# Altium schematic sheet POWER SUPPLY.SchDoc: POWER SUPPLY
size A3; CheckedBy: HungDV; DrawnBy: HungDV; SheetNumber: 3; SheetTotal: 5
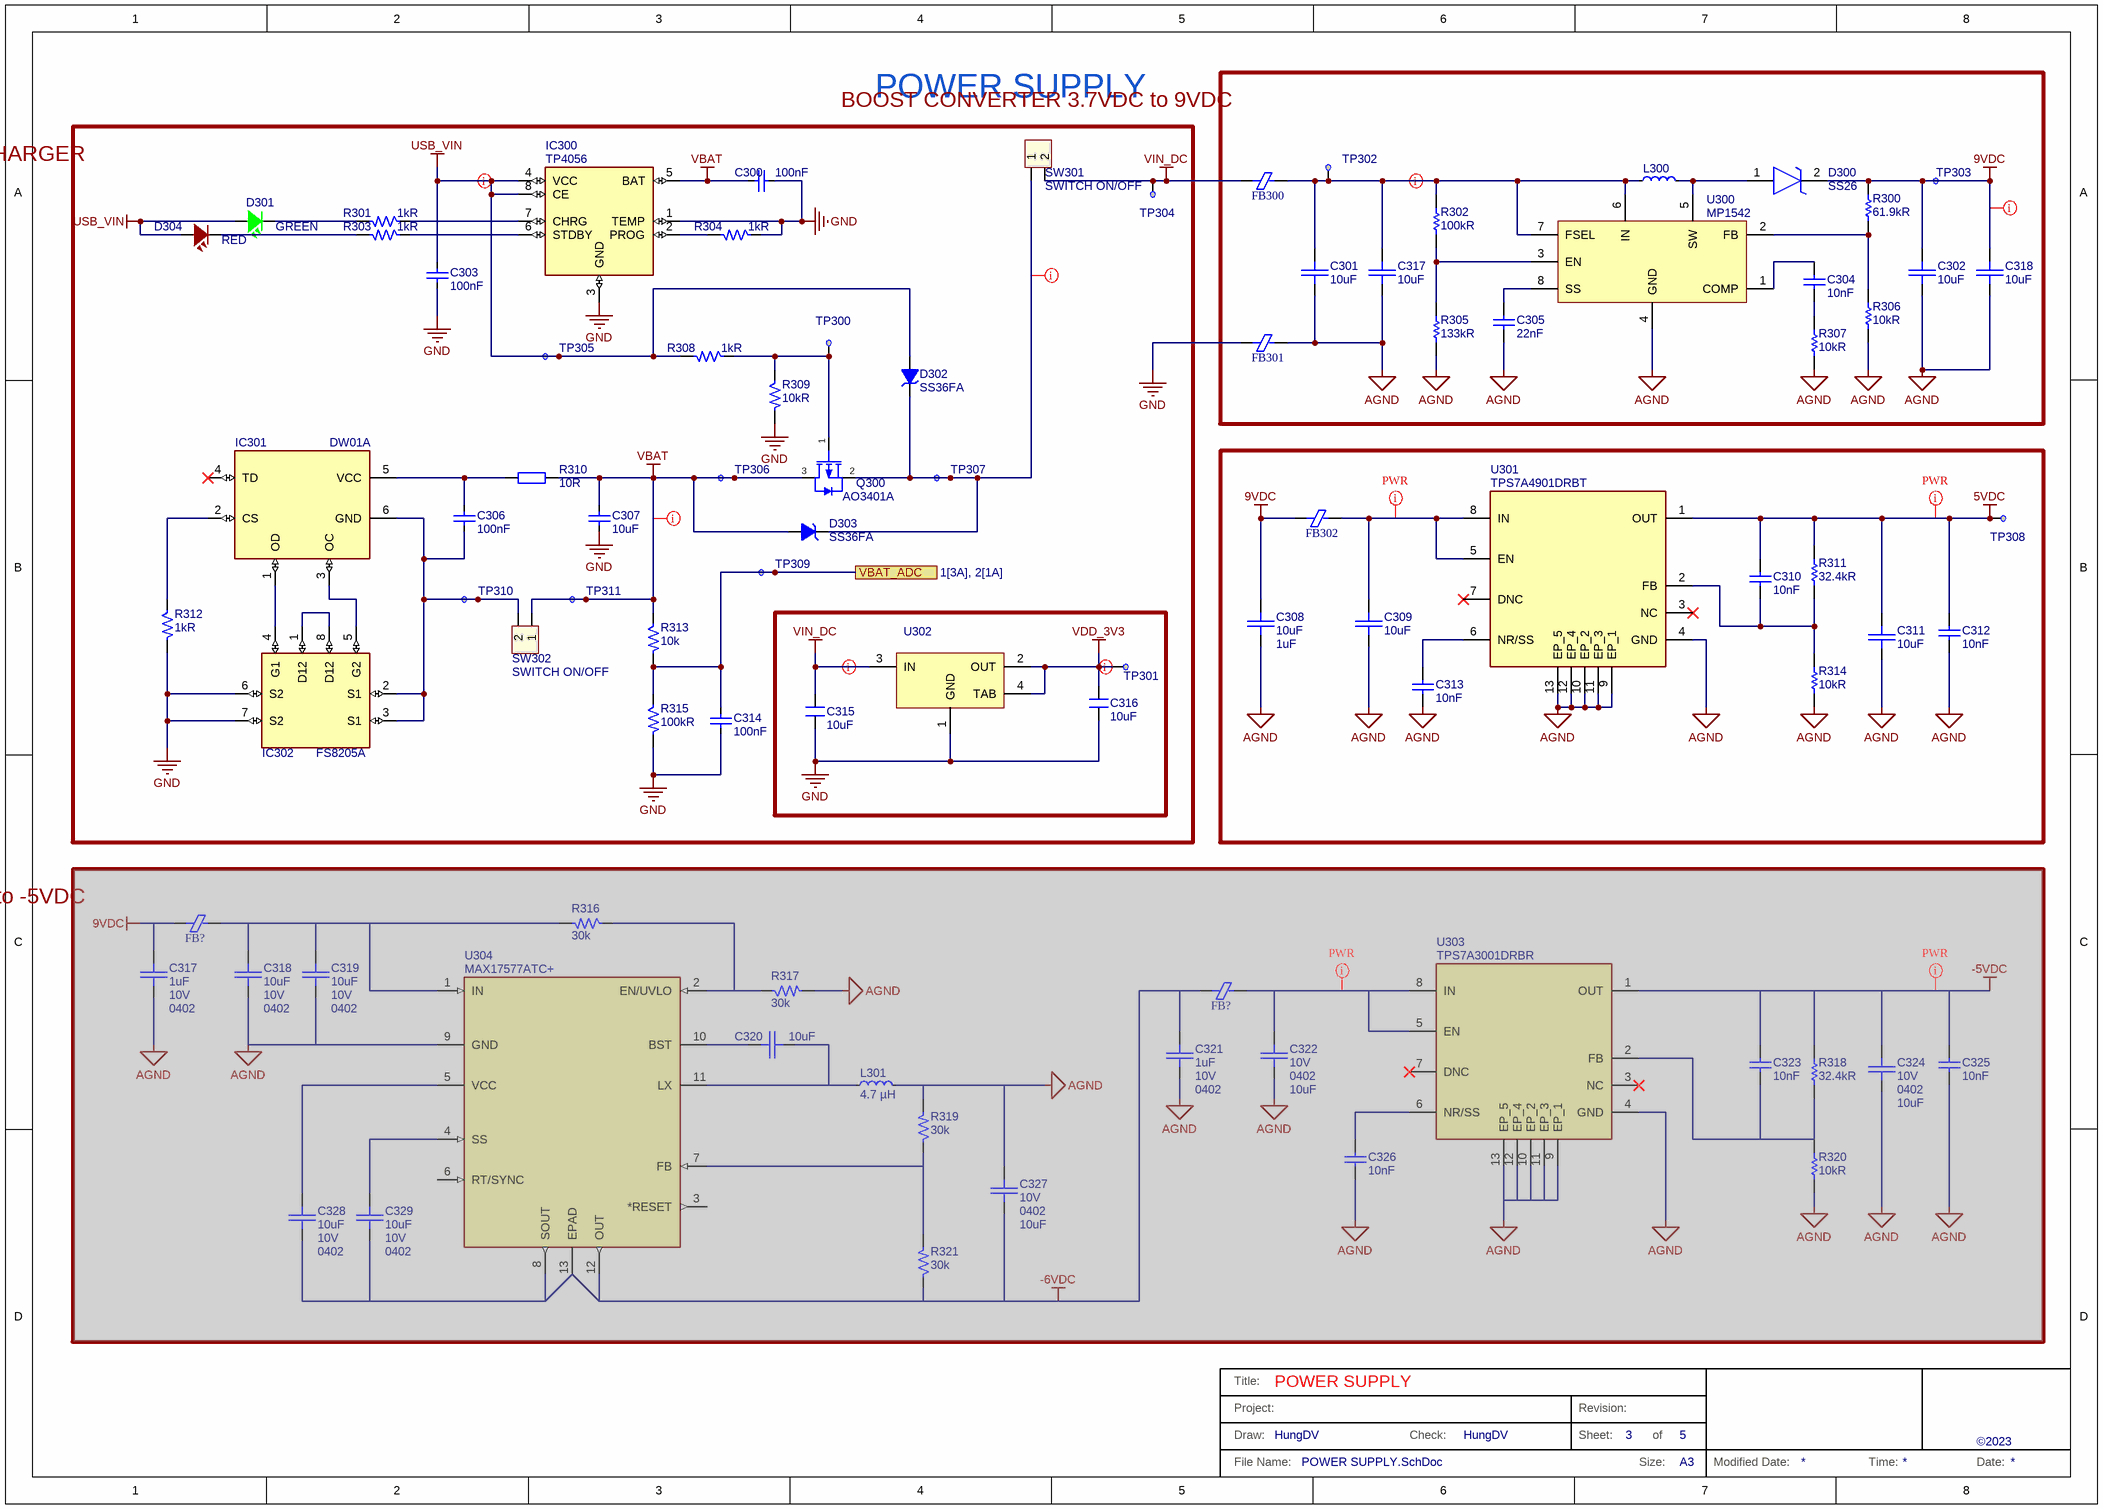
[diagram p0: POWER SUPPLY.SchDoc]

## Parts
(Parts that share a designator on the sheet are numbered #1, #2 ... from top to bottom, then left to right.)
C300  100nF  [CAP0603-M]
C301  10uF  [C0805]
C302  10uF  [C0805]
C303  100nF  [CAP0603-M]
C304  10nF  [CAP0603-M]
C305  22nF  [CAP0603-M]
C306  100nF  [CAP0603-M]
C307  10uF  [CAP0603-M]
C308  10uF  Capacitance: 1uF  [CAP0603-M]
C309  10uF  [CAP0603-M]
C310  Capacitance: 10nF  [CAP0603-M]  (hidden comment: 10uF)
C311  10uF  [CAP0603-M]
C312  Capacitance: 10nF  [CAP0603-M]  (hidden comment: 10uF)
C313  Capacitance: 10nF  [CAP0603-M]  (hidden comment: 10uF)
C314  100nF  [CAP0603-M]
C315  10uF  [C0805]
C316  10uF  [C0805]
C317#1  10uF  [C0805]
C317#2  Capacitance: 1uF  Voltage Rating: 10V  Case Code (Imperial): 0402  [CAPC1005X65N]  (hidden comment: CAP CER 10UF 10V X5R 0402)  (masked out: inside a compile mask, not in the netlist)
C318#1  10uF  [C0805]
C318#2  Capacitance: 10uF  Voltage Rating: 10V  Case Code (Imperial): 0402  [CAPC1005X65N]  (hidden comment: CAP CER 10UF 10V X5R 0402)  (masked out: inside a compile mask, not in the netlist)
C319  Capacitance: 10uF  Voltage Rating: 10V  Case Code (Imperial): 0402  [CAPC1005X65N]  (hidden comment: CAP CER 10UF 10V X5R 0402)  (masked out: inside a compile mask, not in the netlist)
C320  Capacitance: 10uF  [CAPC1005X65N]  (hidden comment: CAP CER 10UF 10V X5R 0402)  (masked out: inside a compile mask, not in the netlist)
C321  Capacitance: 1uF  Voltage Rating: 10V  Case Code (Imperial): 0402  [CAPC1005X65N]  (hidden comment: CAP CER 10UF 10V X5R 0402)  (masked out: inside a compile mask, not in the netlist)
C322  Voltage Rating: 10V  Case Code (Imperial): 0402  Capacitance: 10uF  [CAP0603-M]  (hidden comment: CAP CER 10UF 10V X5R 0402)  (masked out: inside a compile mask, not in the netlist)
C323  Capacitance: 10nF  [C0201]  (hidden comment: CAP CER 10000PF 25V X5R 0201)  (masked out: inside a compile mask, not in the netlist)
C324  Voltage Rating: 10V  Case Code (Imperial): 0402  Capacitance: 10uF  [CAP0603-M]  (hidden comment: CAP CER 10UF 10V X5R 0402)  (masked out: inside a compile mask, not in the netlist)
C325  Capacitance: 10nF  [C0201]  (hidden comment: CAP CER 10000PF 25V X5R 0201)  (masked out: inside a compile mask, not in the netlist)
C326  Capacitance: 10nF  [C0201]  (hidden comment: CAP CER 10000PF 25V X5R 0201)  (masked out: inside a compile mask, not in the netlist)
C327  Voltage Rating: 10V  Case Code (Imperial): 0402  Capacitance: 10uF  [CAP0603-M]  (hidden comment: CAP CER 10UF 10V X5R 0402)  (masked out: inside a compile mask, not in the netlist)
C328  Capacitance: 10uF  Voltage Rating: 10V  Case Code (Imperial): 0402  [CAPC1005X65N]  (hidden comment: CAP CER 10UF 10V X5R 0402)  (masked out: inside a compile mask, not in the netlist)
C329  Capacitance: 10uF  Voltage Rating: 10V  Case Code (Imperial): 0402  [CAPC1005X65N]  (hidden comment: CAP CER 10UF 10V X5R 0402)  (masked out: inside a compile mask, not in the netlist)
D300  SS26  [SOD123F]
D301  GREEN  [LED RIGHT]
D302  SS36FA  [SOD123F]
D303  SS36FA  [SOD123F]
D304  RED  [LED RIGHT]
FB300  FerriteBead 220Ohms @100MHz 0201  [INDC1608X80N]  (value not drawn)
FB301  FerriteBead 220Ohms @100MHz 0201  [INDC1608X80N]  (value not drawn)
FB302  FerriteBead 220Ohms @100MHz 0201  [INDC1608X80N]  (value not drawn)
FB?#1  FerriteBead 220Ohms @100MHz 0201  [INDC1005X65N]  (value not drawn)  (masked out: inside a compile mask, not in the netlist)
FB?#2  FerriteBead 220Ohms @100MHz 0201  [INDC1005X65N]  (value not drawn)  (masked out: inside a compile mask, not in the netlist)
IC300  TP4056  [TP4056]
IC301  DW01A  [SOT23-6]
IC302  FS8205A  [FS8205A]
L300  FIXED IND 4.7UH 1.1A 288MOHM SMD  [IND25X25CZ]  (value not drawn)
L301  Inductance: 4.7 µH  [1285ASH1R0MP2]  (hidden comment: FIXED IND 4.7UH 1.1A 288MOHM SMD)  (masked out: inside a compile mask, not in the netlist)
Q300  AO3401A  [SOT23-3]
R300  61.9kR  [R_0603]
R301  1kR  [R_0603]
R302  100kR  [R_0603]
R303  1kR  [R_0603]
R304  1kR  [R_0603]
R305  133kR  [R_0603]
R306  10kR  [R_0603]
R307  10kR  [R_0603]
R308  1kR  [R_0603]
R309  10kR  [R_0603]
R310  10R  [R_0603]
R311  32.4kR  [R_0603]
R312  1kR  [R_0603]
R313  10k  [R_0603]
R314  10kR  [R_0603]
R315  100kR  [R_0603]
R316  30k  [RES0603]  (masked out: inside a compile mask, not in the netlist)
R317  30k  [RES0603]  (masked out: inside a compile mask, not in the netlist)
R318  Resistance: 32.4kR  [R0201]  (hidden comment: RES 11.3K OHM 1% 1/20W 0201)  (masked out: inside a compile mask, not in the netlist)
R319  30k  [RES0603]  (masked out: inside a compile mask, not in the netlist)
R320  Resistance: 10kR  [R0201]  (hidden comment: RES 10K OHM 1% 1/20W 0201)  (masked out: inside a compile mask, not in the netlist)
R321  30k  [RES0603]  (masked out: inside a compile mask, not in the netlist)
SW301  SWITCH ON/OFF  [XH2.54]
SW302  SWITCH ON/OFF  [XH2.54]
TP300  SIREN_EN  [TPH]  (value not drawn)  (no BOM)
TP301  3V3  [TPH]  (value not drawn)  (no BOM)
TP302  VIN  [TPH]  (value not drawn)  (no BOM)
TP303  9VDC  [TPH]  (value not drawn)  (no BOM)
TP304  SIREN_EN  [TPH]  (value not drawn)  (no BOM)
TP305  SIREN_EN  [TPH]  (value not drawn)  (no BOM)
TP306  VBAT  [TPH]  (value not drawn)  (no BOM)
TP307  SIREN_EN  [TPH]  (value not drawn)  (no BOM)
TP308  5V  [TPH]  (value not drawn)  (no BOM)
TP309  SIREN_EN  [TPH]  (value not drawn)  (no BOM)
TP310  SIREN_EN  [TPH]  (value not drawn)  (no BOM)
TP311  SIREN_EN  [TPH]  (value not drawn)  (no BOM)
U300  MP1542  [TSOP65P490X95-8N]
U301  TPS7A4901DRBT  [IC_DRV8601DRBT]
U302  LM1117-3.3  [SOT223-4]  (value not drawn)
U303  200-mA, low-noise, high-PSRR, negative, adjustable low-dropout voltage  [IC_DRV8601DRBT]  (value not drawn)  (masked out: inside a compile mask, not in the netlist)
U304  MAX17577ATC+  [21-0664E_TD1233-1C_MXM]  (masked out: inside a compile mask, not in the netlist)

## Blocks framed on the sheet
BATTERY CHARGER: C300 C303 C306 C307 C314-C316 D301-D304 IC300-IC302 Q300 R301 R303 R304 R308-R310 R312 R313 R315 SW301 SW302 TP300 TP301 TP304-TP307 TP309-TP311 U302
BOOST CONVERTER 3.7VDC to 9VDC: C301 C302 C304 C305 C317#1 C318#1 D300 FB300 FB301 L300 R300 R302 R305-R307 TP302 TP303 U300
NEGATIVE POWER SUPPLY -9VDC to -5VDC: C317#2 C318#2 C319-C329 FB?#1 FB?#2 L301 R316-R321 U303 U304

## Ports
VBAT_ADC (see 1[3A], 2[1A])

## Nets
5VDC: C310.2 C311.2 C312.2 R311.2 TP308.1(TP) U301.1(OUT)
9VDC: C302.2 C308.2 C318#1.2 D300.2(K) FB302.1 R300.2 TP303.1(TP)
AGND: C301.1 C302.1 C305.1 C308.1 C309.1 C311.1 C312.1 C313.1 C317#1.1 C318#1.1 FB301.2 R305.1 R306.1 R307.1 R314.1 U300.4(GND) U301.4(GND) U301.9(EP_1) U301.10(EP_2) U301.11(EP_3) U301.12(EP_4) U301.13(EP_5)
GND: C300.1 C303.2 C307.1 C314.1 C315.1 C316.1 FB301.1 IC300.1(TEMP) IC300.3(GND) IC302.6(S2) IC302.7(S2) R304.1 R309.2 R312.2 R315.2 U302.1(GND)
USB_VIN: C303.1 D301.1 D302.1 D304.1 IC300.4(VCC) IC300.8(CE) R308.2 TP305.1(TP)
VBAT: C300.2 C307.2 D303.1(A) IC300.5(BAT) Q300.3(DRAIN) R310.2 R313.1 SW302.1 TP306.1(TP) TP311.1(TP)
VDD_3V3: C316.2 TP301.1(TP) U302.2(OUT) U302.4(TAB)
VIN_DC: C315.2 FB300.1 SW301.2 TP304.1(TP) U302.3(IN)
VBAT_ADC: C314.2 R313.2 R315.1 TP309.1(TP) ; port VBAT_ADC
NetC301_2: C301.2 C317#1.2 FB300.2 L300.1 R302.2 TP302.1(TP) U300.6(IN) U300.7(FSEL)
NetC304_1: C304.1 R307.2
NetC304_2: C304.2 U300.1(COMP)
NetC305_2: C305.2 U300.8(SS)
NetC306_1: C306.1 IC301.6(GND) IC302.2(S1) IC302.3(S1) SW302.2 TP310.1(TP)
NetC306_2: C306.2 IC301.5(VCC) R310.1
NetC309_2: C309.2 FB302.2 U301.5(EN) U301.8(IN)
NetC310_1: C310.1 R311.1 R314.2 U301.2(FB)
NetC313_2: C313.2 U301.6(NR/SS)
NetD300_1: D300.1(A) L300.2 U300.5(SW)
NetD301_2: D301.2 R301.2
NetD302_2: D302.2 D303.2(K) Q300.2(SOURCE) SW301.1 TP307.1(TP)
NetD304_2: D304.2 R303.2
NetIC300_2: IC300.2(PROG) R304.2
NetIC300_6: IC300.6(STDBY) R303.1
NetIC300_7: IC300.7(CHRG) R301.1
NetIC301_1: IC301.1(OD) IC302.4(G1)
NetIC301_2: IC301.2(CS) R312.1
NetIC301_3: IC301.3(OC) IC302.5(G2)
NetIC302_1: IC302.1(D12) IC302.8(D12)
NetQ300_1: Q300.1(GATE) R308.1 R309.1 TP300.1(TP)
NetR300_1: R300.1 R306.2 U300.2(FB)
NetR302_1: R302.1 R305.2 U300.3(EN)

Not connected (* = marked no-connect by the designer): IC301 4(TD)*; U301 3(NC)* 7(DNC)*

## Layout directives
net class PWR: 5VDC, 9VDC, (no net found under the mark), NetC301_2, NetC309_2, NetD302_2, USB_VIN, VBAT, VDD_3V3, VIN_DC

## Notes on the sheet
- Title:
- Project:
- Draw:
- Check:
- Revision:
- Sheet:
- of
- ©2023
- File Name:
- Size:
- A3
- Modified Date:
- Time:
- Date:

## Library data of the parts
C300 C303 C306 C314 = CapSMD: CAP CER 100nF 16V X5R 0603
C301 C302 C317#1 C318#1 = CAP_10uF_0402: CAP CER 10UF 16V X5R 0805; Manufacturer 1: Samsung; Manufacturer Part Number 1: CL05A106MP8NUB8; Revision: 2; Manufacturer 2: Murata; Manufacturer Part Number 2: GRM155R61A106ME11D; Capacitance: 10uF
C304 = CAP_10nF_0402
C305 = CAP_10nF_0402: CAP CER  22nF 50V C0G/NP0 0603
C307 = CapSMD: CAP CER 10UF 16V X5R 0603
C308 = CAP_10uF_0402: CAP CER 10UF 16V X5R 0603; Manufacturer 1: Samsung; Manufacturer Part Number 1: CL05A106MP8NUB8; Revision: 2; Manufacturer 2: Murata; Manufacturer Part Number 2: GRM155R61A106ME11D
C309 C311 = CAP_10uF_0402: CAP CER 10UF 16V X5R 0603; Manufacturer Part Number 1: CL05A106MP8NUB8; Manufacturer 1: Samsung; Revision: 2; Manufacturer 2: Murata; Manufacturer Part Number 2: GRM155R61A106ME11D; Capacitance: 10uF
C310 C312 C313 = CAP_10nF_0201: CAP CER 10UF 16V X5R 0603; Manufacturer 1: Taiyo Yuden; Manufacturer Part Number 1: TMK063BJ103KP-F; Manufacturer 2: Murata; Manufacturer Part Number 2: GRM033R61A103KA01D
C315 C316 = S1200-000091: CAP CER 10UF 16V X5R 0603; Manufacturer: MURATA; Component Kind: Standard; Footprint: C_0603
C317#2 C318#2 C319-C321 C328 C329 = CAP_10uF_0402: 10 µF ±20% 10V Ceramic Capacitor X5R 0402 (1005 Metric); Manufacturer 1: Samsung; Manufacturer Part Number 1: CL05A106MP8NUB8; Earable Part Number: ERB000054; RoHS: Yes; Revision: 2; Supplier 1: Digi-Key; Supplier Part Number 1: 1276-6830-2-ND; Category: Ceramic Capacitors; Stock 1: 4668844; Pricing 1: 8000=0.07888, 16000=0.07642, 24000=0.07395, 56000=0.06902 (USD); RoHS Compliant: Yes; ComponentLink1URL: http://www.samsungsem.com/kr/support/product-search/mlcc/CL05A106MP8NUB8.jsp?src-supplier=Digi-Key; ComponentLink1Description: http://www.samsungsem.com/kr/support/product-search/mlcc/CL05A106MP8NUB8.jsp?src-supplier=Digi-Key; Manufacturer 2: Murata; Manufacturer Part Number 2: GRM155R61A106ME11D; Tolerance: 20%; Mount: Surface Mount; Case/Package: 0603; Case Code (Metric): 1005; Min Operating Temperature: -55°C; Max Operating Temperature: 85°C; Packaging: Tape and Reel; Length: 0.039inch; Width: 0.02inch; Thickness: 0.035inch; Supplier 2: Mouser; Pricing 2: 1=0.19000, 10=0.13400, 50=0.13400, 100=0.06300, 1000=0.03800, 10000=0.02900 (USD); Supplier Part Number 2: 81-GRM155R61A106ME1D; RoHS 1: Yes; RoHS 2: Yes; Stock 2: 8811
C322 C324 C327 = CAP_10uF_0402: 10 µF ±20% 10V Ceramic Capacitor X5R 0402 (1005 Metric); Manufacturer Part Number 1: CL05A106MP8NUB8; Manufacturer 1: Samsung; Earable Part Number: ERB000054; Supplier Part Number 1: 1276-6830-2-ND; RoHS: Yes; Revision: 2; Category: Ceramic Capacitors; Mount: Surface Mount; Case/Package: 0603; Case Code (Metric): 1005; Min Operating Temperature: -55°C; Max Operating Temperature: 85°C; Packaging: Tape and Reel; Length: 0.039inch; Manufacturer 2: Murata; Manufacturer Part Number 2: GRM155R61A106ME11D; Supplier Part Number 2: 81-GRM155R61A106ME1D
C323 C325 C326 = CAP_10nF_0201: 10000 pF ±10% 25V Ceramic Capacitor X5R 0201 (0603 Metric); Earable Part Number: ERB000057; Manufacturer 1: Taiyo Yuden; Manufacturer Part Number 1: TMK063BJ103KP-F; Manufacturer 2: Murata; Manufacturer Part Number 2: GRM033R61A103KA01D; Supplier Part Number 1: 587-5945-1-ND; RoHS: Yes; Category: Ceramic Capacitors; Mount: Surface Mount; Case/Package: 0201; Case Code (Imperial): 0201; Case Code (Metric): 0603; Min Operating Temperature: -55°C; Max Operating Temperature: 85°C; Package Quantity: 15000; Voltage Rating: 25V; Packaging: Tape and Reel; Dielectric: X5R; Resistor Type: Ceramic; Length: 0.6mm; Height: 0.3mm; Depth: 0.3mm; Lead Free: Lead Free; Halogen Free: Halogen Free
D300 = DF2S6.8MFS,L3M: TVS Diode (Uni-directional); Manufacturer_Name: SEMTECH
D301 = LED_1: LED GREEN
D302 D303 = DIODE_ZEN CBB: DIODE ZENER 15V 410MW SOD123
D304 = LED_3: LED RED
FB300-FB302 = FerriteBead_220Ohm_0402: 220 Ohms @ 100 MHz 1 Power Line Ferrite Bead 0402 (1005 Metric) 1.5A 95mOhm; Manufacturer 1: TDK; Manufacturer Part Number 1: MPZ1005S221HT000; Manufacturer 2: Murata; Manufacturer Part Number 2: BLM15PX221SN1D
FB?#1 FB?#2 = FerriteBead_220Ohm_0402: 220 Ohms @ 100 MHz 1 Power Line Ferrite Bead 0402 (1005 Metric) 1.5A 95mOhm; Earable Part Number: ERB000100; Manufacturer 1: TDK; Manufacturer Part Number 1: MPZ1005S221HT000; Impedance: 220Ohm @100Mhz; Manufacturer 2: Murata; Manufacturer Part Number 2: BLM15PX221SN1D; Supplier 1: Digi-Key; Supplier Part Number 1: 445-MPZ1005S221HT000CT-ND; RoHS: Yes; Category: Ferrite Beads and Chips; Stock 1: 5544; Pricing 1: 1=0.12000, 10=0.09900, 25=0.08920, 50=0.06540, 100=0.05640, 250=0.04456, 500=0.03762, 1000=0.03168, 5000=0.02822 (USD); Case: 0402; DC Resistance (DCR): 95mOhm
IC300 = TP4056: Complete single cell Li-Ion battery with a constant current / constant voltage linear charger
IC301 = DW01A: One Cell Lithium-ion/Polymer Battery Protection IC
L300 = DFE201610E-4R7M=P2: 4.7 µH Shielded Wirewound Inductor 1.1 A 288mOhm Max 0806 (2016 Metric); Manufacturer 1: Murata; Manufacturer Part Number 1: DFE201610E-4R7M=P2
L301 = DFE201610E-4R7M=P2: 4.7 µH Shielded Wirewound Inductor 1.1 A 288mOhm Max 0806 (2016 Metric); Manufacturer 1: Murata; Current - Saturation (Isat): 1.6 A; Manufacturer Part Number 1: DFE201610E-4R7M=P2; Supplier 1: Digi-Key; Supplier Part Number 1: 490-18108-1-ND; RoHS: Yes; Category: Fixed Inductors; Stock 1: 81905; Pricing 1: 1=0.37000, 10=0.32800, 25=0.28680, 50=0.24560, 100=0.22520, 250=0.20476, 500=0.19246, 1000=0.14742 (USD); RoHS Compliant: Yes; ComponentLink1URL: http://www.farnell.com/datasheets/2339713.pdf?src-supplier=Farnell; ComponentLink1Description: http://www.farnell.com/datasheets/2339713.pdf?src-supplier=Farnell
Q300 = P-MOSFET_TP1_CBB: MOSFET P-CH 30V 4A SOT23-3L
R300 = RES_100K_0201: RES SMD 61.9k OHM 1% 1/8W 0603; Manufacturer 1: Yageo; Manufacturer Part Number 1: RC0201FR-07100KL; Revision: 1; Manufacturer Part Number 2: ERJ-1GNF1003C; Manufacturer 2: Panasonic Electronic Components
R301 R303 R304 R308 R312 = R: RES SMD 1K OHM 1% 1/8W 0603; Manufacturer: Yageo
R302 = RES_100K_0201: RES SMD 100K OHM 1% 1/8W 0603; Manufacturer 1: Yageo; Manufacturer Part Number 1: RC0201FR-07100KL; Revision: 1; Manufacturer Part Number 2: ERJ-1GNF1003C; Manufacturer 2: Panasonic Electronic Components
R305 = RES_100K_0201: RES SMD 133K OHM 1% 1/8W 0603; Manufacturer 1: Yageo; Manufacturer Part Number 1: RC0201FR-07100KL; Revision: 1; Manufacturer Part Number 2: ERJ-1GNF1003C; Manufacturer 2: Panasonic Electronic Components
R306 R307 = RES_100K_0201: RES SMD 10K OHM 1% 1/8W 0603; Manufacturer 1: Yageo; Manufacturer Part Number 1: RC0201FR-07100KL; Revision: 1; Manufacturer Part Number 2: ERJ-1GNF1003C; Manufacturer 2: Panasonic Electronic Components
R309 = R: RES SMD 10K OHM 1% 1/8W 0603; Manufacturer: Yageo
R310 = Resistor - SMD: RES SMD 10R OHM 1% 1/8W 0603; Manufacturer: Generic Components
R311 = RES_10K_0201: RES SMD 32.4k OHM 1% 1/8W 0603; Manufacturer 1: Yageo; Manufacturer Part Number 1: RC0201FR-0711K3L; Revision: 1; Manufacturer 2: Panasonic Electronic Components
R313 = R: RES SMD 10K OHM 1% 1/8W 0805; Manufacturer: Yageo
R314 = RES_10K_0201: RES SMD 10K OHM 1% 1/8W 0603; Manufacturer 1: Yageo; Manufacturer Part Number 1: RC0201FR-0710KL; Revision: 1; Manufacturer 2: Panasonic Electronic Components; Manufacturer Part Number 2: ERJ-1GEF1002C
R315 = R: RES SMD 100K OHM 1% 1/8W 0603; Manufacturer: Yageo
R316 R317 R319 R321 = R: RES SMD 10K OHM 1% 1/8W 0805; Manufacturer: Yageo; Part number: RC0805FR-071KL; User_Description: RES SMD 1K OHM 1% 1/8W 0805; Value: 1k; Category: RESISTORS; Package: 0805
R318 = RES_10K_0201: 11.3kOhms ±1% 0.05W, 1/20W Chip Resistor 0201 (0603 Metric) Moisture Resistant Thick Film; Manufacturer 1: Yageo; Manufacturer Part Number 1: RC0201FR-0711K3L; Earable Part Number: ERB000112; RoHS: Y; Revision: 1; Supplier Part Number 1: P10.0KABCT-ND; Category: Chip SMD Resistors; Case/Package: 0201; Case Code (Metric): 0603; Case Code (Imperial): 0201; Min Operating Temperature: -55°C; Max Operating Temperature: 155°C; Packaging: Tape and Reel; Resistor Type: Thick Film; Length: 0.024inch; Height: 0.01inch; Supplier Part Number 2: 311-10.0KMCT-ND; Manufacturer 2: Panasonic Electronic Components
R320 = RES_10K_0201: 10 kOhms ±1% 0.05W, 1/20W Chip Resistor 0201 (0603 Metric) Moisture Resistant Thick Film; Manufacturer 1: Yageo; Manufacturer Part Number 1: RC0201FR-0710KL; Earable Part Number: ERB000079; RoHS: Y; Revision: 1; Supplier Part Number 1: P10.0KABCT-ND; Category: Chip SMD Resistors; Case/Package: 0201; Case Code (Metric): 0603; Case Code (Imperial): 0201; Min Operating Temperature: -55°C; Max Operating Temperature: 155°C; Packaging: Tape and Reel; Resistor Type: Thick Film; Length: 0.024inch; Height: 0.01inch; Supplier Part Number 2: 311-10.0KMCT-ND; Manufacturer 2: Panasonic Electronic Components; Manufacturer Part Number 2: ERJ-1GEF1002C
SW301 SW302 = Con2: Connector 2
TP300-TP311 = S1400-000002: Test_Point_1mm; Footprint: TP_1mm
U301 = TPS7A4901DRBT: IC REG LINEAR POS ADJ 150MA 8SON; Manufacturer Part Number 1: IC REG LINEAR POS ADJ 150MA 8SON
U302 = S1001-000002: IC REG LINEAR 3.3V 1A SOT223; Manufacturer: DIODE; Component Kind: Standard; Manufacturer Part Number 1: LM1117-3.3
U303 = TPS7A3001DRBR: 200-mA, low-noise, high-PSRR, negative, adjustable low-dropout voltage regulator with enable; Earable Part Number: ERB000089; Supplier Part Number 1: 595-TPS7A3001DRBR; Manufacturer Part Number 1: TPS7A3001DRBR
U304 = MAX17577ATC+: No Description Available; Mfr_Name: Analog Devices / Maxim Integrated; Copyright: Copyright (C) 2024 Ultra Librarian. All rights reserved.; Manufacturer_Part_Number: MAX17577ATC+; RefDes: RefDes; Type: DEV
U300 = MP1542: Manufacturer Part Number 1: MP1542